# EAGLE design RP2040Breakout (EAGLE 7.6.0)
COMPANY: ADAFRUIT INDUSTRIES; DRAWN: KTOWN; REV: B
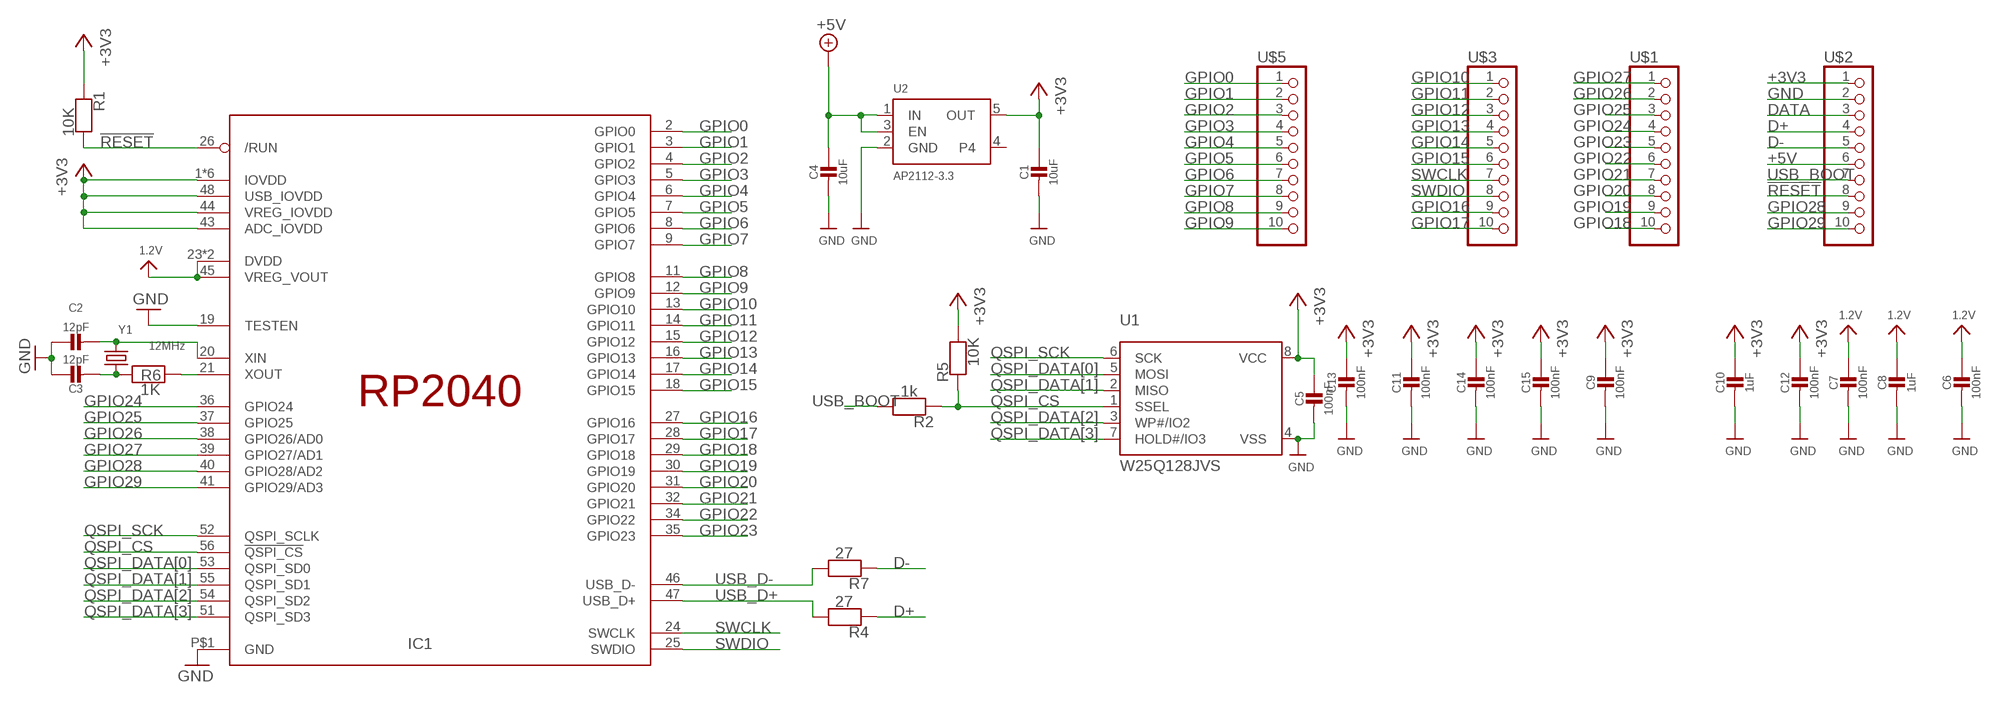
[diagram p0: schematic, sheet 1]

## Parts
C1  10uF  CAP_CERAMIC_0805MP  [_0805MP]
C2  12pF  CAP_CERAMIC_0402NO  [_0402NO]
C3  12pF  CAP_CERAMIC_0402NO  [_0402NO]
C4  10uF  CAP_CERAMIC_0805MP  [_0805MP]
C5  100nF  CAP_CERAMIC_0402NO  [_0402NO]
C6  100nF  CAP_CERAMIC_0402NO  [_0402NO]
C7  100nF  CAP_CERAMIC_0402NO  [_0402NO]
C8  1uF  CAP_CERAMIC_0402NO  [_0402NO]
C9  100nF  CAP_CERAMIC_0402NO  [_0402NO]
C10  1uF  CAP_CERAMIC_0402NO  [_0402NO]
C11  100nF  CAP_CERAMIC_0402NO  [_0402NO]
C12  100nF  CAP_CERAMIC_0402NO  [_0402NO]
C13  100nF  CAP_CERAMIC_0402NO  [_0402NO]
C14  100nF  CAP_CERAMIC_0402NO  [_0402NO]
C15  100nF  CAP_CERAMIC_0402NO  [_0402NO]
IC1  RP2040_QFN56  [QFN56_7MM_REDUCEDEPAD]
R1  10K  RESISTOR_0402NO  [_0402NO]
R2  1k  RESISTOR_0402NO  [_0402NO]
R4  27  RESISTOR_0402NO  [_0402NO]
R5  10K  RESISTOR_0402NO  [_0402NO]
R6  1K  RESISTOR_0402NO  [_0402NO]
R7  27  RESISTOR_0402NO  [_0402NO]
U1  W25Q128JVS  SPIFLASH_8PIN208MIL  [SOIC8_208MIL]
U2  AP2112-3.3  VREG_SOT23-5  [SOT23-5@1]
U$1  HEADER-1X10ROUND  [1X10_ROUND]
U$2  HEADER-1X10ROUND  [1X10_ROUND]
U$3  HEADER-1X10ROUND  [1X10_ROUND]
U$5  HEADER-1X10ROUND  [1X10_ROUND]
Y1  12MHz  CRYSTALCRYSTAL-SMD-5X3-12MHZ  [CRYSTAL-SMD-5X3]

## Nets
1.2V: C6.1 C7.1 C8.1 IC1.23(DVDD) IC1.45(VREG_VOUT) IC1.50(DVDD)
!RESET: IC1.26(/RUN) R1.2 U$2.8
+3V3: C1.1 C5.1 C9.1 C10.1 C11.1 C12.1 C13.1 C14.1 C15.1 IC1.1(IOVDD) IC1.10(IOVDD) IC1.22(IOVDD) IC1.33(IOVDD) IC1.42(IOVDD) IC1.43(ADC_IOVDD) IC1.44(VREG_IOVDD) IC1.48(USB_IOVDD) IC1.49(IOVDD) R1.1 R5.2 U1.8(VCC) U2.5(OUT) U$2.1
+5V: C4.1 U2.1(IN) U2.3(EN) U$2.6
D+: R4.1 U$2.4
D-: R7.1 U$2.5
DATA: U$2.3
GND [power]: C1.2 C2.1 C3.1 C4.2 C5.2 C6.2 C7.2 C8.2 C9.2 C10.2 C11.2 C12.2 C13.2 C14.2 C15.2 IC1.19(TESTEN) IC1.P$1(GND) U1.4(VSS) U2.2(GND) U$2.2
GPIO0: IC1.2(GPIO0) U$5.1
GPIO1: IC1.3(GPIO1) U$5.2
GPIO2: IC1.4(GPIO2) U$5.3
GPIO3: IC1.5(GPIO3) U$5.4
GPIO4: IC1.6(GPIO4) U$5.5
GPIO5: IC1.7(GPIO5) U$5.6
GPIO6: IC1.8(GPIO6) U$5.7
GPIO7: IC1.9(GPIO7) U$5.8
GPIO8: IC1.11(GPIO8) U$5.9
GPIO9: IC1.12(GPIO9) U$5.10
GPIO10: IC1.13(GPIO10) U$3.1
GPIO11: IC1.14(GPIO11) U$3.2
GPIO12: IC1.15(GPIO12) U$3.3
GPIO13: IC1.16(GPIO13) U$3.4
GPIO14: IC1.17(GPIO14) U$3.5
GPIO15: IC1.18(GPIO15) U$3.6
GPIO16: IC1.27(GPIO16) U$3.9
GPIO17: IC1.28(GPIO17) U$3.10
GPIO18: IC1.29(GPIO18) U$1.10
GPIO19: IC1.30(GPIO19) U$1.9
GPIO20: IC1.31(GPIO20) U$1.8
GPIO21: IC1.32(GPIO21) U$1.7
GPIO22: IC1.34(GPIO22) U$1.6
GPIO23: IC1.35(GPIO23) U$1.5
GPIO24: IC1.36(GPIO24) U$1.4
GPIO25: IC1.37(GPIO25) U$1.3
GPIO26: IC1.38(GPIO26/AD0) U$1.2
GPIO27: IC1.39(GPIO27/AD1) U$1.1
GPIO28: IC1.40(GPIO28/AD2) U$2.9
GPIO29: IC1.41(GPIO29/AD3) U$2.10
N$1: IC1.21(XOUT) R6.2
N$5: C2.2 IC1.20(XIN) Y1.3
N$6: C3.2 R6.1 Y1.1
QSPI_CS: IC1.56(!QSPI_CS) R2.1 R5.1 U1.1(SSEL)
QSPI_DATA[0]: IC1.53(QSPI_SD0) U1.5(MOSI)
QSPI_DATA[1]: IC1.55(QSPI_SD1) U1.2(MISO)
QSPI_DATA[2]: IC1.54(QSPI_SD2) U1.3(WP#/IO2)
QSPI_DATA[3]: IC1.51(QSPI_SD3) U1.7(HOLD#/IO3)
QSPI_SCK: IC1.52(QSPI_SCLK) U1.6(SCK)
SWCLK: IC1.24(SWCLK) U$3.7
SWDIO: IC1.25(SWDIO) U$3.8
USB_BOOT: R2.2 U$2.7
USB_D+: IC1.47(USB_D+) R4.2
USB_D-: IC1.46(USB_D-) R7.2
Unconnected: U2.4

## Library data of the parts
C1-C15 = microbuilder2:CAP_CERAMIC: Ceramic Capacitors For new designs, use the packages preceded by an '_' character since they are more reliable: The following footprints should be used on most boards: _0402 - Standard footprint for regular board layouts _0603 - Standard footprint for regular board layouts _0805 - Standard footprint for regular board layouts _1206 - Standard footprint for regular board layouts For extremely tight-pitch boards where space is at a premium, the following 'micro-pitch' footprints can be used (smaller pads, no silkscreen outline, etc.): _0402MP - Micro-pitch footprint for very dense/compact boards _0603MP - Micro-pitch footprint for very dense/compact boards _0805MP - Micro-pitch footprint for very dense/compact boards _1206MP - Micro-pitch footprint for very dense/compact boards
IC1 = adafruit_micro:RP2040
R1 R2 R4-R7 = microbuilder2:RESISTOR: Resistors For new designs, use the packages preceded by an '_' character since they are more reliable: The following footprints should be used on most boards: _0402 - Standard footprint for regular board layouts _0603 - Standard footprint for regular board layouts _0805 - Standard footprint for regular board layouts _1206 - Standard footprint for regular board layouts For extremely tight-pitch boards where space is at a premium, the following 'micro-pitch' footprints can be used (smaller pads, no silkscreen outline, etc.): _0402MP - Micro-pitch footprint for very dense/compact boards _0603MP - Micro-pitch footprint for very dense/compact boards _0805MP - Micro-pitch footprint for very dense/compact boards _1206MP - Micro-pitch footprint for very dense/compact boards
U1 = microbuilder:SPIFLASH_8PIN: SOIC8 SPI Flash Be careful with the size since SOIC8 flash comes in several 'widths' SOIC8 150 mil M25P16 - 16Mbit (2Mbit x 8) Serial Flash (75MHz SPI Bus), Supply: 2.7-3.6V Digikey: SOIC8 - M25P16-VMN6P-ND SOIC8 208 mil W25Q16BVSSIG - 16Mbit (2Mbit x 8) Serial Flash (104MHz SPI Bus), Supply: 2.7-3.6V Digikey: SOIC8 - W25Q16BVSSIG-ND
U2 = microbuilder:VREG_SOT23-5: SOT23-5 Fixed Voltage Regulators Part Current Out V Out V In V Dropout θJA (°C/W) TJ (°C) Digikey Part No. ADP121 150mA 3.3V 3.4-5.5V 0.09V @ 150mA -- -- ADP121-AUJZ33R7CT-ND ADP121 150mA 3.0V 3.1-5.5V 0.09V @ 150mA -- -- ADP121-AUJZ30R7CT-ND ADP122 300mA 3.3V 3.4-5.5V 0.085V @ 300mA -- -- ADP122AUJZ-3.3-R7CT-ND ADP1712 300mA 3.3V 3.5-5.5V 0.17V @ 300mA -- -- ADP1712AUJZ-3.3-R7TR-ND AP7311 (Low Cost) 150mA 3.3V 3.5-6V 0.15V @ 150mA -- -- AP7311-33WG-7DICT-ND LD39015M18R 150mA 1.8V 1.9V-5.5V 0.08V @ 100mA -- -- 497-6977-1-ND LP2985A-33DBVR 150mA 3.3V 3.3-16V 0.28V @ 150mA 206 150 296-18479-1-ND MCP1824T-3302E/OT 300mA 3.3V 3.5V-6V 0.2V @ 300mA -- -- MCP1824T-3302E/OTCT-ND MIC5205-2.5YM5 TR 150mA 2.5V 2.7-16V 0.165V @ 150mA -- -- 576-1257-2-ND MIC5205-3.0YM5 TR 150mA 3.0V 3.2V-16V 0.165V @ 150mA -- -- 576-1258-2-ND MIC5205-3.3YM5 TR 150mA 3.3V 3.5V-16V 0.165V @ 150mA -- -- 576-1259-2-ND TPS780330220 150mA 3.3V+2.2V 3.6-5.5V 250mV Max -- -- 296-23332-1-ND TDA3663/N1,135 100mA 3.3V 3.5-45V 0.18V @ 50mA -- -- 568-5343-1-ND Max operating temp can be calculated using θJA, TJ (max junction temperature), and power in watts. Set the "Maximum Ambient Temperature" until it reaches TJ ("Max Junction Temperature"), which is the absolute limit for safe use of the regulator: Heat Sink Temperature Calculator <http://www.daycounter.com/Calculators/Heat-Sink-Temperature-Calculator.phtml> For example, With 12V source into a 3.3V LP2985 and a 30mA load, we are dissipating (12V-3.3V) * 0.03A = 0.261W. With a θJA of 206 °C/W, a TJ of 150°C, and 261mW we can safely use the chip without a heat sink up to 75°C (=147.1°C Junction Temperature).
U$1-U$3 U$5 = microbuilder:HEADER-1X10: PIN HEADER
Y1 = SparkFun-FreqCtrl:CRYSTAL: Various standard crystals. Proven footprints.; PROD_ID: XTAL-08297

## Net classes
1 power: width 0.305 mm
2 gnd: width 0.254 mm

## Board
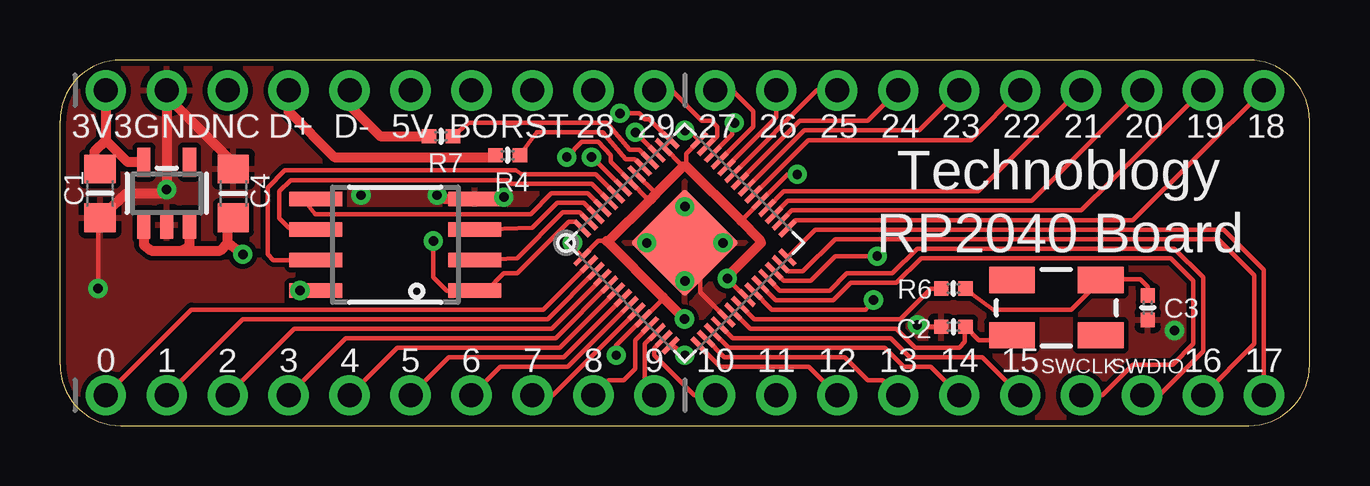
[diagram p1: board, top side]
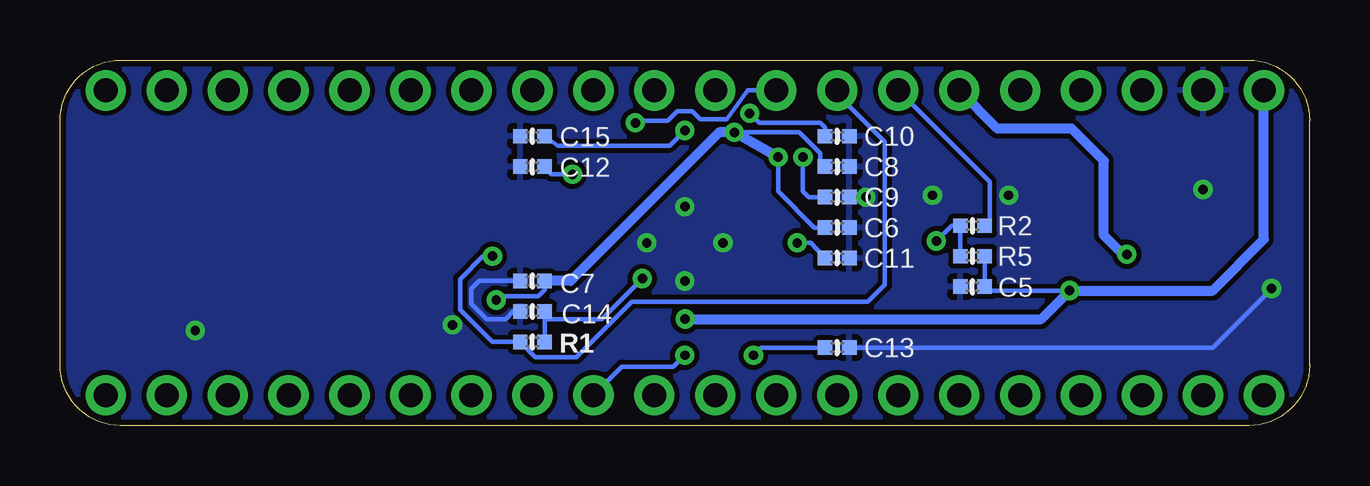
[diagram p2: board, bottom side, seen from below]

Size 52.07 x 15.24 mm. Coordinates in mm from the lower left corner, seen from the top.
Outline: 2.54,0 49.53,0 arc90 52.07,2.54 52.07,12.7 arc90 49.53,15.24 2.54,15.24 arc90 0,12.7 0,2.54 arc90 2.54,0
Copper layers (1*16): Top 0.035mm / dielectric 1.5mm / Bottom 0.035mm
Design rules "adafruit 7-7 *": minimum track width 7mil, minimum drill 15.5mil, track to track 8mil, track to pad 7mil, pad to pad 7mil, via to via 7mil, smd to smd 7mil, copper to edge 10mil, drill to drill 8mil, minimum pad ring 10mil, minimum via ring 8mil, stop-mask expansion 2mil, vias tented up to drill 20mil, thermal gap 10mil

### Footprints (pad centres in the part's own frame; a part is rotated, then mirrored left to right if it is on the bottom)
_0805MP = smd 1.2 x 1.3: 1 -1.016,0; 2 1.016,0
_0402NO = smd 0.6 x 0.6: 1 -0.508,0; 2 0.508,0
QFN56_7MM_REDUCEDEPAD = smd 0.875 x 0.2: 1 -3.45,2.6; 2 -3.45,2.2; 3 -3.45,1.8; 4 -3.45,1.4; 5 -3.45,1; 6 -3.45,0.6; 7 -3.45,0.2; 8 -3.45,-0.2; 9 -3.45,-0.6; 10 -3.45,-1; 11 -3.45,-1.4; 12 -3.45,-1.8; 13 -3.45,-2.2; 14 -3.45,-2.6; 29 3.45,-2.6; 30 3.45,-2.2; 31 3.45,-1.8; 32 3.45,-1.4; 33 3.45,-1; 34 3.45,-0.6; 35 3.45,-0.2; 36 3.45,0.2; 37 3.45,0.6; 38 3.45,1; 39 3.45,1.4; 40 3.45,1.8; 41 3.45,2.2; 42 3.45,2.6 | smd 0.2 x 0.875: 15 -2.6,-3.45; 16 -2.2,-3.45; 17 -1.8,-3.45; 18 -1.4,-3.45; 19 -1,-3.45; 20 -0.6,-3.45; 21 -0.2,-3.45; 22 0.2,-3.45; 23 0.6,-3.45; 24 1,-3.45; 25 1.4,-3.45; 26 1.8,-3.45; 27 2.2,-3.45; 28 2.6,-3.45; 43 2.6,3.45; 44 2.2,3.45; 45 1.8,3.45; 46 1.4,3.45; 47 1,3.45; 48 0.6,3.45; 49 0.2,3.45; 50 -0.2,3.45; 51 -0.6,3.45; 52 -1,3.45; 53 -1.4,3.45; 54 -1.8,3.45; 55 -2.2,3.45; 56 -2.6,3.45 | smd 3.2 x 3.2: P$1 0,0
SOIC8_208MIL = smd 0.6 x 2.2: 1 -1.905,-3.315; 2 -0.635,-3.315; 3 0.635,-3.315; 4 1.905,-3.315; 5 1.905,3.315; 6 0.635,3.315; 7 -0.635,3.315; 8 -1.905,3.315
SOT23-5@1 = smd 0.55 x 1.2: 1 -0.95,-1.3; 2 0,-1.3; 3 0.95,-1.3; 4 0.95,1.3; 5 -0.95,1.3
1X10_ROUND = drill 1 pad 1.676: 1 -11.43,0; 2 -8.89,0; 3 -6.35,0; 4 -3.81,0; 5 -1.27,0; 6 1.27,0; 7 3.81,0; 8 6.35,0; 9 8.89,0; 10 11.43,0
CRYSTAL-SMD-5X3 = smd 1.9 x 1.1: 1 -1.85,-1.15; 2 1.85,-1.15; 3 1.85,1.15; 4 -1.85,1.15

### Placement (x,y rotation side)
C1  1.67,9.68 270 top
C2  37.23,4.13 0 top
C3  45.32,4.92 90 top
C4  7.22,9.68 90 top
C5  14.05,5.79 180 bottom
C6  19.68,8.26 0 bottom
C7  32.38,6.03 180 bottom
C8  19.68,10.79 0 bottom
C9  19.68,9.53 0 bottom
C10  19.68,12.06 0 bottom
C11  19.68,6.99 0 bottom
C12  32.38,10.79 180 bottom
C13  19.68,3.25 0 bottom
C14  32.38,4.76 180 bottom
C15  32.38,12.06 180 bottom
IC1  26.04,7.62 45 top
R1  32.38,3.49 180 bottom
R2  14.05,8.33 0 bottom
R4  18.65,11.27 0 top
R5  14.05,7.06 0 bottom
R6  37.23,5.71 180 top
R7  15.88,12.06 0 top
U1  13.97,7.54 90 top
U2  4.45,9.68 0 top
U$1  38.73,13.97 0 top
U$2  13.34,13.97 0 top
U$3  38.73,1.27 0 top
U$5  13.34,1.27 0 top
Y1  41.51,4.92 180 top

### Tracks (layer width: path | path; a pad name or v marks a point on that pad's centre or on a via)
1.2V  (via drill 0.39)
  Top 0.178: IC1.45 v23.97,12.22 | 28.92,5.61 IC1.23 29.66,4.84 33.58,4.84 v33.89,5.24 | v22.15,11.19 22.5,10.87 IC1.50
  Bottom 0.178: 20.02,10.89 C8.1 20.4,11 20.4,11.35 21.27,12.22 v23.97,12.22 | v22.15,11.19 22.15,9.76 20.64,8.26 C6.1 | C7.1 31.88,5.67 32.15,5.4 33.73,5.4 v33.89,5.24
  Bottom 0.406: v22.15,11.19 v23.97,12.22 24.61,12.22 30.8,6.03 C7.1
!RESET  (via drill 0.39)
  Top 0.178: IC1.26 30.16,6.03 31.27,6.03 32.31,7.06 v34.05,7.06
  Bottom 0.178: U$2.8 19.68,13.81 17.7,11.83 17.7,5.87 18.41,5.16 28.26,5.16 30.56,2.86 32.26,2.86 R1.2 34.05,3.49 35.4,4.84 35.4,6.11 34.45,7.06 v34.05,7.06
+3V3  (via drill 0.39)
  Top 0.178: IC1.1 21.78,7.02 | v10,5.64 U1.8 | 27.83,6.11 v27.8,6.13 | v23.18,2.94 23.16,3.33 IC1.10 24.3,4.46 25.12,5.28 25.12,5.36 | v21.35,7.62 21.56,7.22 IC1.1 | 22.78,7.7 22.44,7.7 IC1.1 | 25.96,10.81 IC1.44 IC1.43 24.55,12.78 24.37,12.78 24.13,13.02 v23.34,13.02 | 26.1,10.81 26.1,11.34 26.64,11.87 IC1.42 26.23,12.3 v26.04,12.3 | 29.18,9.34 28.38,8.53 | IC1.33 29.2,9.35 30.32,10.48 v30.72,10.48 | v21.11,11.19 21.75,11.83 22.43,11.83 22.94,11.27 22.94,11 IC1.49 | IC1.49 23.77,10.2 | 24.04,10.48 IC1.48 24.8,9.7 24.8,9.64 | 24.57,9.41 24.53,9.41 IC1.49 | 27.78,6.19 27.78,6.16 v27.8,6.13 | v27.8,6.13 IC1.22
  Top 0.203: IC1.33 29.18,9.34
  Top 0.406: 27.78,6.19 29.21,7.62 29.13,7.78 28.38,8.53 26.1,10.81 25.96,10.81 25.96,10.79 24.8,9.64 24.57,9.41 22.86,7.7 22.78,7.7 25.12,5.36 v26.02,4.46 v26.02,4.45 | U$2.1 1.91,11.91 | 1.91,11.91 1.43,11.43 1.43,10.7 C1.1 | U2.5 2.83,10.98 1.91,11.91
  Bottom 0.178: v10,5.64 13.4,5.62 C5.1 R5.2 | C13.1 22.86,3.25 v23.18,2.94 | C11.1 20.8,7.62 v21.35,7.62 | 20.41,9.62 C9.1 20.88,9.53 21.11,9.76 v21.11,11.19 | C15.1 31.34,11.67 26.67,11.67 v26.04,12.3 | C10.1 20.19,12.41 20.4,12.62 22.94,12.62 v23.34,13.02 | v27.8,6.13 29.49,4.45 31.8,4.45 C14.1 R1.1 | C12.1 31.88,10.76 31.59,10.48 v30.72,10.48
  Bottom 0.406: U$2.1 1.91,7.78 4.05,5.64 v10,5.64 11.19,4.45 v26.02,4.45
+5V  (via drill 0.39)
  Top 0.406: U2.1 3.5,7.54 3.81,7.3 5.08,7.3 | 5.08,7.3 6.67,7.3 6.99,7.62 | 6.99,7.62 6.99,8.59 C4.1 | U2.3 5.39,7.46 5.08,7.3 | v7.62,7.14 6.99,7.62
  Bottom 0.406: v7.62,7.14 7.78,7.14 8.57,7.94 8.57,11.03 9.92,12.38 13.02,12.38 U$2.6
D+
  Top 0.406: U$2.4 9.53,13.1 11.43,11.19 17.92,11.19 R4.1
D-
  Top 0.406: U$2.5 12.06,13.34 13.34,12.06 R7.1
GND  (via drill 0.39)
  Top 0.178: C2.1 35.8,4.13 v35.72,4.21 | 26.67,6.99 26.67,5.57 IC1.19 | v26.04,6.03 IC1.P$1 26.04,8.89 | v1.59,5.71 1.59,8.59 C1.2
  Top 0.406: U$2.2 4.45,13.73 | 4.45,13.73 4.45,9.68 2.78,9.68 1.6,8.59 C1.2 | C4.2 7.22,10.95 4.45,13.73 | U1.4 16.03,9.45 15.95,9.53
  Bottom 0.178: C14.2 33.18,4.76 33.5,4.45 34.29,4.45 34.92,5.08 34.92,5.71 34.61,6.03 C7.2 | C13.2 4.05,3.25 v1.59,5.71
  other vias: 26.04,9.13 27.62,7.62 24.45,7.62 12.54,9.6 46.43,3.97 18.49,9.53 15.72,9.6 4.45,9.84
  pour Top: 0,15.24 0,0 52.07,0.02 52.07,15.24
  pour Bottom: 52.04,0 0,0 0,15.24 52.04,15.24
GPIO0
  Top 0.178: U$5.1 5.48,4.84 20.15,4.84 IC1.2
GPIO1
  Top 0.178: IC1.3 20.31,4.45 7.62,4.45 U$5.2
GPIO2
  Top 0.178: IC1.4 20.48,4.05 9.76,4.05 U$5.3
GPIO3
  Top 0.178: IC1.5 20.65,3.65 11.91,3.65 U$5.4
GPIO4
  Top 0.178: U$5.5 14.05,3.25 20.82,3.25 IC1.6
GPIO5
  Top 0.178: U$5.6 16.19,2.86 20.99,2.86 IC1.7
GPIO6
  Top 0.178: U$5.7 18.34,2.46 21.16,2.46 IC1.8
GPIO7
  Top 0.178: U$5.8 20.53,1.27 IC1.9
GPIO8
  Top 0.178: IC1.11 23.97,3.57 23.97,2.38 23.5,1.91 22.86,1.91 U$5.9
GPIO9
  Top 0.178: IC1.12 24.37,3.41 24.37,1.51 U$5.10
GPIO10
  Top 0.178: U$3.1 26.43,1.27 24.77,2.94 24.77,3.24 IC1.13
GPIO11  (via drill 0.39)
  Top 0.178: IC1.14 25.55,3.34 v26.04,2.94
  Bottom 0.178: U$3.2 28.65,2.46 26.51,2.46 v26.04,2.94
GPIO12
  Top 0.178: U$3.3 31.19,2.46 27.52,2.46 IC1.15
GPIO13
  Top 0.178: IC1.16 27.69,2.86 32.7,2.86 33.66,1.91 34.29,1.91 U$3.4
GPIO14
  Top 0.178: IC1.17 27.86,3.25 34.37,3.25 35.16,2.46 36.27,2.46 U$3.5
GPIO15
  Top 0.178: U$3.6 38.42,2.86 35.4,2.86 34.61,3.65 28.02,3.65 IC1.18
GPIO16
  Top 0.178: U$3.9 49.77,3.41 49.77,6.27 48.26,7.78 32.31,7.78 30.96,6.43 30.34,6.43 IC1.27
GPIO17
  Top 0.178: IC1.28 31.47,8.18 48.5,8.18 50.16,6.51 U$3.10
GPIO18
  Top 0.178: IC1.29 30.37,8.22 30.64,8.57 44.69,8.57 U$1.10
GPIO19
  Top 0.178: IC1.30 30.03,8.52 30.48,8.97 42.55,8.97 U$1.9
GPIO20
  Top 0.178: IC1.31 30.33,9.37 40.48,9.37 U$1.8
GPIO21
  Top 0.178: IC1.32 30.16,9.76 38.26,9.76 42.47,13.97 U$1.7
GPIO22
  Top 0.178: IC1.34 31.17,11.91 37.94,11.91 U$1.6
GPIO23
  Top 0.178: 28.65,9.92 IC1.35 31,12.3 35.8,12.3 U$1.5
GPIO24
  Top 0.178: IC1.36 30.83,12.7 33.66,12.7 U$1.4
GPIO25
  Top 0.178: IC1.37 31.54,13.97 U$1.3
GPIO26
  Top 0.178: IC1.38 29.14,12.14 29.14,12.15 29.84,12.86 U$1.2
GPIO27
  Top 0.178: IC1.39 28.89,12.46 28.89,13.1 28.02,13.97 U$1.1
GPIO28  (via drill 0.39)
  Top 0.178: v28.1,12.62 28.02,12.54 28.02,12.14 27.93,12.06 IC1.40
  Bottom 0.178: v28.1,12.62 28.02,12.7 26.75,12.7 26.35,13.1 25.72,13.1 25.4,12.78 24.29,12.78 23.42,13.97 U$2.9
GPIO29
  Top 0.178: IC1.41 26.93,11.62 27.38,12.06 27.38,12.46 27.15,12.7 26.75,12.7 25.48,13.97 U$2.10
N$1
  Top 0.178: 28.38,5.04 IC1.21 28.93,4.45 35,4.45 36.27,5.71 R6.2
N$5
  Top 0.178: IC1.20 28.76,4.05 34.85,4.05 35.64,3.25 37.47,3.25 37.7,3.49 37.7,4.1 C2.2 38.29,3.57 39.62,3.57 Y1.3
N$6
  Top 0.178: R6.1 38.02,5.48 38.89,4.84 42.13,4.84 Y1.1 43.4,6.11 45.01,6.11 45.32,5.79 C3.2
QSPI_CS  (via drill 0.39)
  Top 0.178: IC1.56 21.47,8.49 21.19,8.49 19.05,6.35 18.49,6.35 17.78,5.64 U1.1 16.11,5.64 15.56,6.19 v15.56,7.7
  Bottom 0.178: v15.56,7.7 14.92,8.33 R2.1 R5.1
QSPI_DATA[0]
  Top 0.178: U1.5 10.08,9.53 10.64,8.81 19.61,8.81 20.48,9.68 21.99,9.68 IC1.53
QSPI_DATA[1]
  Top 0.178: U1.2 19.05,6.99 20.95,8.89 21.65,8.89 IC1.55
QSPI_DATA[2]
  Top 0.178: U1.3 19.68,8.26 20.72,9.29 21.82,9.29 IC1.54
QSPI_DATA[3]
  Top 0.178: U1.7 8.89,6.91 8.65,7.14 8.65,9.92 9.37,10.64 19,10.64 19.23,10.48 22.33,10.48 IC1.51 23.15,9.63
QSPI_SCK
  Top 0.178: U1.6 9.53,8.26 9.13,8.65 9.13,9.76 9.6,10.24 18.65,10.24 18.81,10.08 22.16,10.08 IC1.52
SWCLK
  Top 0.178: IC1.24 29.83,5.24 32.23,5.24 32.94,5.95 34.85,5.95 35.88,6.99 46.28,6.99 47.23,6.03 47.23,3.41 46.35,2.54 44.69,2.54 43.42,1.27 U$3.7
SWDIO
  Top 0.178: IC1.25 30,5.64 32.07,5.64 32.78,6.35 34.69,6.35 35.72,7.38 46.43,7.38 47.62,6.19 47.62,3.1 45.8,1.27 U$3.8
USB_BOOT
  Bottom 0.178: R2.2 13.41,8.33 13.34,8.26 13.34,10.16 U$2.7
USB_D+
  Top 0.178: IC1.47 23.96,11.11 23.57,11.11 22.62,12.22 19.86,12.22 R4.2
USB_D-
  Top 0.178: IC1.46 24.13,11.51 23.73,11.51 22.78,12.62 17.02,12.62 R7.2

### Text on the board
tPlace: 3V3 | GND | NC | D+ | D- | 5V | BO | RST | 28 | 29 | 27 | 26 | 25 | 24 | 23 | 22 | 21 | 20 | 19 | 18 | Technoblogy | RP2040 Board | 0 | 1 | 2 | 3 | 4 | 5 | 6 | 7 | 8 | 9 | 10 | 11 | 12 | 13 | 14 | 15 | 16 | 17 | SWCLK | SWDIO